# Altium schematic sheet 7-SEGMENT_DISPLAY_4_DIGITS.SchDoc: CLOCK'S FACE
size A4; Author: Én; Organization: PIFLab; Address1: Room 304, B1 Block; Address2: HCMUT; Address3: 268 Ly Thuong Kiet St.; Address4: Ward 14, District 10, HCMC; Revision: rev; SheetNumber: 1; SheetTotal: 2; ProjectTitle: CLOCK'S FACE
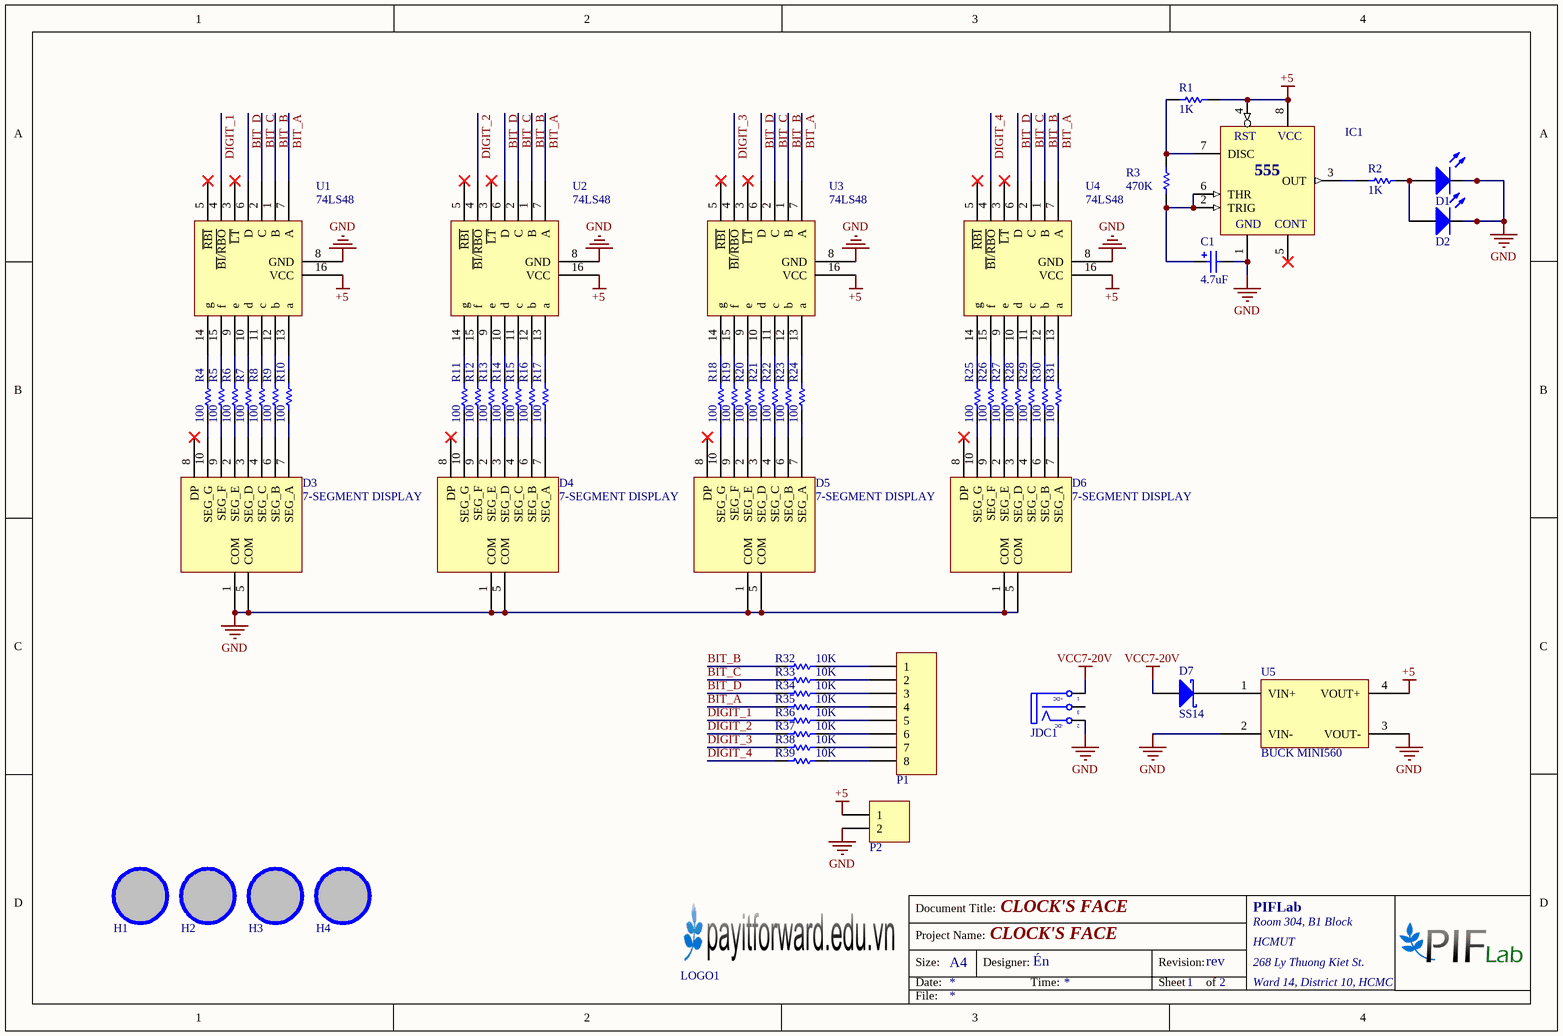
[diagram p0: 7-SEGMENT_DISPLAY_4_DIGITS.SchDoc]

## Parts
C1  value 4.7uF  [CP1/2]  (hidden comment: Cap Pol)
D1  LED  [LED-3mm]  (value not drawn)
D2  LED  [LED-3mm]  (value not drawn)
D3  7-SEGMENT DISPLAY  [7-SEGMENT]
D4  7-SEGMENT DISPLAY  [7-SEGMENT]
D5  7-SEGMENT DISPLAY  [7-SEGMENT]
D6  7-SEGMENT DISPLAY  [7-SEGMENT]
D7  Supplier Part Number 1: SS14  [SS34]  (hidden comment: D Schottky)
H1  Hole  [LO KHOAN 3MM]  (value not drawn)
H2  Hole  [LO KHOAN 3MM]  (value not drawn)
H3  Hole  [LO KHOAN 3MM]  (value not drawn)
H4  Hole  [LO KHOAN 3MM]  (value not drawn)
IC1  LM555  [DIP8/W0.3]  (value not drawn)
JDC1  Jack DC  [DC-IN]  (value not drawn)
LOGO1  LOGO PIF  [PIF LOGO BIG TOP]  (value not drawn)
P1  Header 8  [JP8]  (value not drawn)
P2  Header 2  [JP2]  (value not drawn)
R1  value 1K  [RES-SM-0805]  (hidden comment: RESISTOR SMD)
R2  value 1K  [RES-SM-0805]  (hidden comment: RESISTOR SMD)
R3  value 470K  [RES-SM-0805]  (hidden comment: RESISTOR SMD)
R4  value 100  [RES-SM-0805]  (hidden comment: RESISTOR SMD)
R5  value 100  [RES-SM-0805]  (hidden comment: RESISTOR SMD)
R6  value 100  [RES-SM-0805]  (hidden comment: RESISTOR SMD)
R7  value 100  [RES-SM-0805]  (hidden comment: RESISTOR SMD)
R8  value 100  [RES-SM-0805]  (hidden comment: RESISTOR SMD)
R9  value 100  [RES-SM-0805]  (hidden comment: RESISTOR SMD)
R10  value 100  [RES-SM-0805]  (hidden comment: RESISTOR SMD)
R11  value 100  [RES-SM-0805]  (hidden comment: RESISTOR SMD)
R12  value 100  [RES-SM-0805]  (hidden comment: RESISTOR SMD)
R13  value 100  [RES-SM-0805]  (hidden comment: RESISTOR SMD)
R14  value 100  [RES-SM-0805]  (hidden comment: RESISTOR SMD)
R15  value 100  [RES-SM-0805]  (hidden comment: RESISTOR SMD)
R16  value 100  [RES-SM-0805]  (hidden comment: RESISTOR SMD)
R17  value 100  [RES-SM-0805]  (hidden comment: RESISTOR SMD)
R18  value 100  [RES-SM-0805]  (hidden comment: RESISTOR SMD)
R19  value 100  [RES-SM-0805]  (hidden comment: RESISTOR SMD)
R20  value 100  [RES-SM-0805]  (hidden comment: RESISTOR SMD)
R21  value 100  [RES-SM-0805]  (hidden comment: RESISTOR SMD)
R22  value 100  [RES-SM-0805]  (hidden comment: RESISTOR SMD)
R23  value 100  [RES-SM-0805]  (hidden comment: RESISTOR SMD)
R24  value 100  [RES-SM-0805]  (hidden comment: RESISTOR SMD)
R25  value 100  [RES-SM-0805]  (hidden comment: RESISTOR SMD)
R26  value 100  [RES-SM-0805]  (hidden comment: RESISTOR SMD)
R27  value 100  [RES-SM-0805]  (hidden comment: RESISTOR SMD)
R28  value 100  [RES-SM-0805]  (hidden comment: RESISTOR SMD)
R29  value 100  [RES-SM-0805]  (hidden comment: RESISTOR SMD)
R30  value 100  [RES-SM-0805]  (hidden comment: RESISTOR SMD)
R31  value 100  [RES-SM-0805]  (hidden comment: RESISTOR SMD)
R32  value 10K  [RES-SM-0805]  (hidden comment: RESISTOR SMD)
R33  value 10K  [RES-SM-0805]  (hidden comment: RESISTOR SMD)
R34  value 10K  [RES-SM-0805]  (hidden comment: RESISTOR SMD)
R35  value 10K  [RES-SM-0805]  (hidden comment: RESISTOR SMD)
R36  value 10K  [RES-SM-0805]  (hidden comment: RESISTOR SMD)
R37  value 10K  [RES-SM-0805]  (hidden comment: RESISTOR SMD)
R38  value 10K  [RES-SM-0805]  (hidden comment: RESISTOR SMD)
R39  value 10K  [RES-SM-0805]  (hidden comment: RESISTOR SMD)
U1  74LS48  [74LS48]
U2  74LS48  [74LS48]
U3  74LS48  [74LS48]
U4  74LS48  [74LS48]
U5  BUCK MINI560  [BUCK MINI560]

## Nets
+5: IC1.4(RST) IC1.8(VCC) P2.1 R1.2 U1.16(VCC) U2.16(VCC) U3.16(VCC) U4.16(VCC) U5.4(VOUT+)
GND: C1.2 D1.2(K) D2.2(K) D3.1(COM) D3.5(COM) D4.1(COM) D4.5(COM) D5.1(COM) D5.5(COM) D6.1(COM) D6.5(COM) IC1.1(GND) JDC1.2(TN) P2.2 U1.8(GND) U2.8(GND) U3.8(GND) U4.8(GND) U5.2(VIN-) U5.3(VOUT-)
VCC7-20V: D7.A JDC1.1(T)
BIT_A: R35.1 U1.7(A) U2.7(A) U3.7(A) U4.7(A)
BIT_B: R32.1 U1.1(B) U2.1(B) U3.1(B) U4.1(B)
BIT_C: R33.1 U1.2(C) U2.2(C) U3.2(C) U4.2(C)
BIT_D: R34.1 U1.6(D) U2.6(D) U3.6(D) U4.6(D)
DIGIT_1: R36.1 U1.4(~{BI}/~{RBO})
DIGIT_2: R37.1 U2.4(~{BI}/~{RBO})
DIGIT_3: R38.1 U3.4(~{BI}/~{RBO})
DIGIT_4: R39.1 U4.4(~{BI}/~{RBO})
NetC1_1: C1.1 IC1.2(TRIG) IC1.6(THR) R3.1
NetD1_1: D1.1(A) D2.1(A) R2.2
NetD3_2: D3.2(SEG_E) R6.1
NetD3_3: D3.3(SEG_D) R7.1
NetD3_4: D3.4(SEG_C) R8.1
NetD3_6: D3.6(SEG_B) R9.1
NetD3_7: D3.7(SEG_A) R10.1
NetD3_9: D3.9(SEG_F) R5.1
NetD3_10: D3.10(SEG_G) R4.1
NetD4_2: D4.2(SEG_E) R13.1
NetD4_3: D4.3(SEG_D) R14.1
NetD4_4: D4.4(SEG_C) R15.1
NetD4_6: D4.6(SEG_B) R16.1
NetD4_7: D4.7(SEG_A) R17.1
NetD4_9: D4.9(SEG_F) R12.1
NetD4_10: D4.10(SEG_G) R11.1
NetD5_2: D5.2(SEG_E) R20.1
NetD5_3: D5.3(SEG_D) R21.1
NetD5_4: D5.4(SEG_C) R22.1
NetD5_6: D5.6(SEG_B) R23.1
NetD5_7: D5.7(SEG_A) R24.1
NetD5_9: D5.9(SEG_F) R19.1
NetD5_10: D5.10(SEG_G) R18.1
NetD6_2: D6.2(SEG_E) R27.1
NetD6_3: D6.3(SEG_D) R28.1
NetD6_4: D6.4(SEG_C) R29.1
NetD6_6: D6.6(SEG_B) R30.1
NetD6_7: D6.7(SEG_A) R31.1
NetD6_9: D6.9(SEG_F) R26.1
NetD6_10: D6.10(SEG_G) R25.1
NetD7_K: D7.K U5.1(VIN+)
NetIC1_3: IC1.3(OUT) R2.1
NetIC1_7: IC1.7(DISC) R1.1 R3.2
NetP1_1: P1.1 R32.2
NetP1_2: P1.2 R33.2
NetP1_3: P1.3 R34.2
NetP1_4: P1.4 R35.2
NetP1_5: P1.5 R36.2
NetP1_6: P1.6 R37.2
NetP1_7: P1.7 R38.2
NetP1_8: P1.8 R39.2
NetR4_2: R4.2 U1.14(g)
NetR5_2: R5.2 U1.15(f)
NetR6_2: R6.2 U1.9(e)
NetR7_2: R7.2 U1.10(d)
NetR8_2: R8.2 U1.11(c)
NetR9_2: R9.2 U1.12(b)
NetR10_2: R10.2 U1.13(a)
NetR11_2: R11.2 U2.14(g)
NetR12_2: R12.2 U2.15(f)
NetR13_2: R13.2 U2.9(e)
NetR14_2: R14.2 U2.10(d)
NetR15_2: R15.2 U2.11(c)
NetR16_2: R16.2 U2.12(b)
NetR17_2: R17.2 U2.13(a)
NetR18_2: R18.2 U3.14(g)
NetR19_2: R19.2 U3.15(f)
NetR20_2: R20.2 U3.9(e)
NetR21_2: R21.2 U3.10(d)
NetR22_2: R22.2 U3.11(c)
NetR23_2: R23.2 U3.12(b)
NetR24_2: R24.2 U3.13(a)
NetR25_2: R25.2 U4.14(g)
NetR26_2: R26.2 U4.15(f)
NetR27_2: R27.2 U4.9(e)
NetR28_2: R28.2 U4.10(d)
NetR29_2: R29.2 U4.11(c)
NetR30_2: R30.2 U4.12(b)
NetR31_2: R31.2 U4.13(a)

Not connected (* = marked no-connect by the designer): D3 8(DP)*; D4 8(DP)*; D5 8(DP)*; D6 8(DP)*; H1 1; H2 1; H3 1; H4 1; IC1 5(CONT)*; JDC1 3(S); U1 3(~{LT})* 5(~{RBI})*; U2 3(~{LT})* 5(~{RBI})*; U3 3(~{LT})* 5(~{RBI})*; U4 3(~{LT})* 5(~{RBI})*

## Notes on the sheet
- Document Title:
- Size:
- Date:
- Project Name:
- A4
- Designer:
- Time:
- Revision:
- Sheet
- of
- File:
- (in symbol Jack DC) +DC; -DC
- (in symbol LM555) 555

## Library data of the parts
C1 = Cap Pol: Polarized Capacitor (Radial)
D3-D6 = 7-SEGMENT
D7 = D Schottky: Schottky Diode; Published: 8-Jun-2000; LatestRevisionDate: 17-Jul-2002; LatestRevisionNote: Re-released for DXP Platform.; PackageReference: SMB; Publisher: Altium Limited; PackageDescription: DO-214-AA/SMB; 2 C-Bend Leads; Body 5.3 x 3.6 mm, inc. leads (LxW); Code_JEDEC: DO-214-AA; Supplier 1: Arrow Electronics; Supplier 2: RSComponents; Supplier Part Number 2: 8080433
H1-H4 = Hole: Hole 3mm
IC1 = LM555: Timer; Value: LM555
JDC1 = Jack DC: Jack DC input; Value: Jac DC
P1 = Header 8: Header, 8-Pin; LatestRevisionDate: 17-Jul-2002; LatestRevisionNote: Re-released for DXP Platform.; Publisher: Altium Limited
P2 = Header 2: Header, 2-Pin; LatestRevisionDate: 17-Jul-2002; LatestRevisionNote: Re-released for DXP Platform.; Publisher: Altium Limited
R1-R39 = RESISTOR SMD: Resistor
U1-U4 = 74LS48: 74LS48 - ACTIVE HIGH
U5 = BUCK MINI560: MODULE BUCK MINI560